# Altium schematic sheet DAC.SchDoc
size A4; SheetNumber: 6; SheetTotal: 8
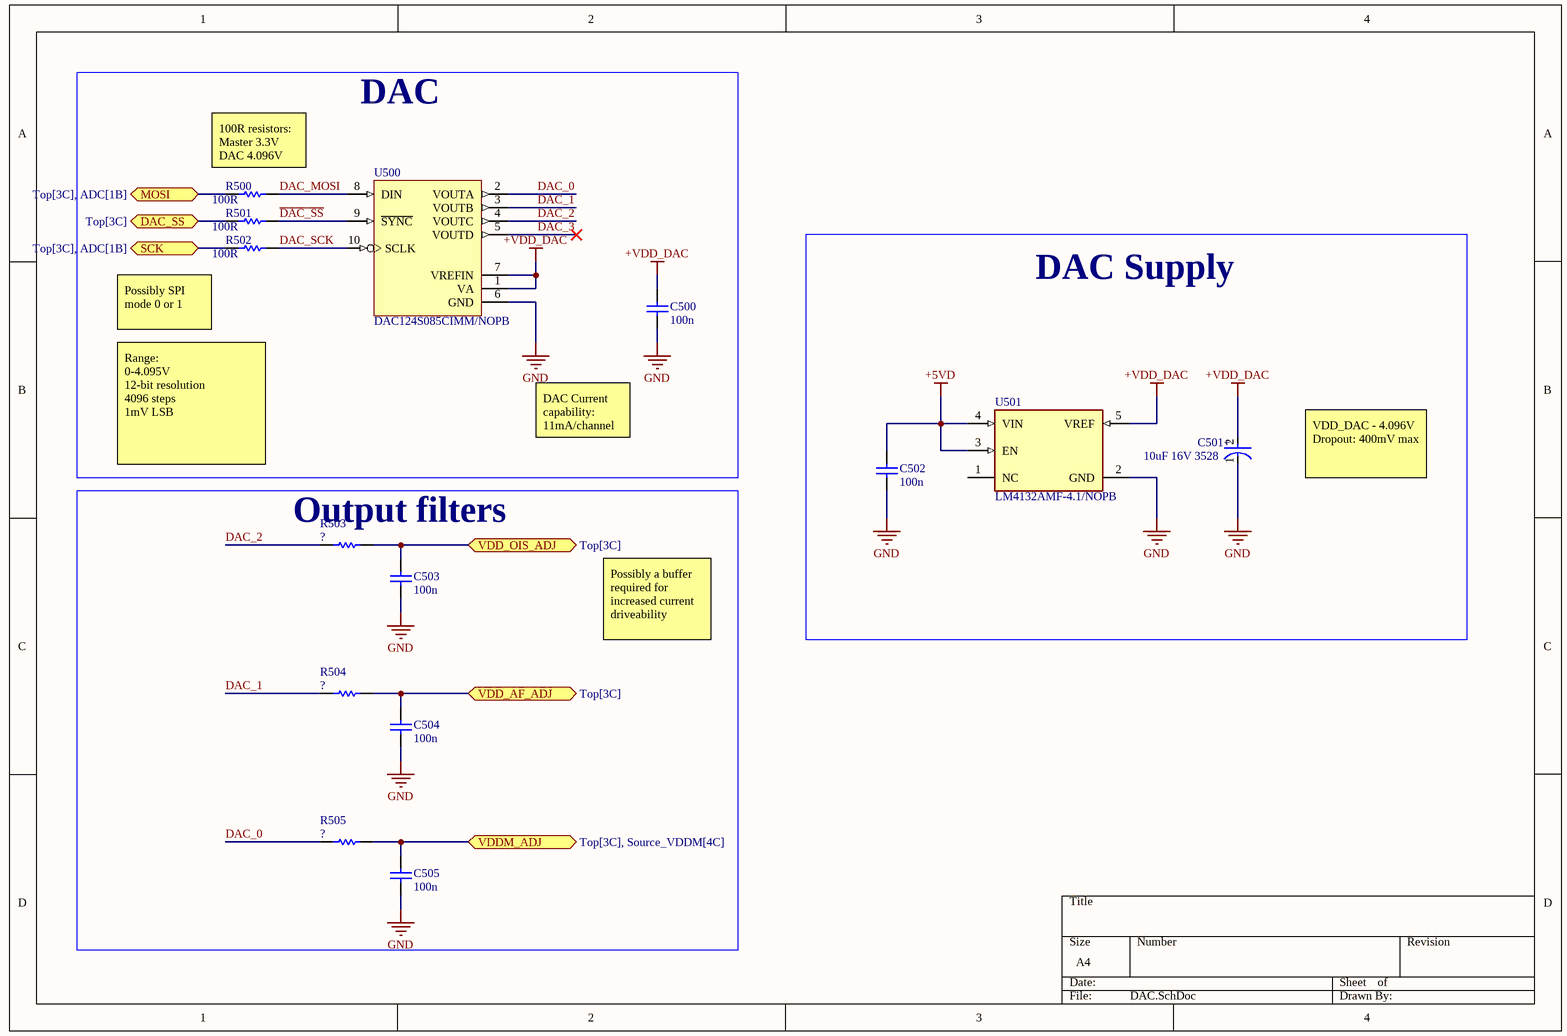
[diagram p0: DAC.SchDoc]

## Parts
C500  100n  [SAMS-C0603-2_M]
C501  10uF 16V 3528  [FP-T491B106K020AT-MFG]
C502  100n  [SAMS-C0603-2_M]
C503  100n  [SAMS-C0603-2_M]
C504  100n  [SAMS-C0603-2_M]
C505  100n  [SAMS-C0603-2_M]
R500  100R  [RESC1608X55X30ML15T15]
R501  100R  [RESC1608X55X30ML15T15]
R502  100R  [RESC1608X55X30ML15T15]
R503  ?  [RESC1608X55X30ML15T15]
R504  ?  [RESC1608X55X30ML15T15]
R505  ?  [RESC1608X55X30ML15T15]
U500  DAC124S085CIMM/NOPB  [MUB10A_L]
U501  LM4132AMF-4.1/NOPB  [FP-DBV0005A-IPC_C]

## Blocks framed on the sheet
DAC: C500 R500-R502 U500
DAC Supply: C501 C502 U501
Output filters: C503-C505 R503-R505

## Ports
DAC_SS (bidir, see Top[3C]), MOSI (bidir, see Top[3C], ADC[1B]), SCK (bidir, see Top[3C], ADC[1B]), VDD_AF_ADJ (bidir, see Top[3C]), VDD_OIS_ADJ (bidir, see Top[3C]), VDDM_ADJ (bidir, see Top[3C], Source_VDDM[4C])

## Nets
+5VD: C502.2 U501.3(EN) U501.4(VIN)
+VDD_DAC: C500.2 C501.2(A) U500.1(VA) U500.7(VREFIN) U501.5(VREF)
GND: C500.1 C501.1(C) C502.1 C503.1 C504.1 C505.1 U500.6(GND) U501.2(GND)
~{DAC_SS}: R501.2 U500.9(~{SYNC})
DAC_0: R505.1 U500.2(VOUTA)
DAC_1: R504.1 U500.3(VOUTB)
DAC_2: R503.1 U500.4(VOUTC)
DAC_3: U500.5(VOUTD)
DAC_MOSI: R500.2 U500.8(DIN)
DAC_SCK: R502.2 U500.10(SCLK)
DAC_SS: R501.1 ; port DAC_SS
MOSI: R500.1 ; port MOSI
SCK: R502.1 ; port SCK
VDD_AF_ADJ: C504.2 R504.2 ; port VDD_AF_ADJ
VDD_OIS_ADJ: C503.2 R503.2 ; port VDD_OIS_ADJ
VDDM_ADJ: C505.2 R505.2 ; port VDDM_ADJ

Not connected (* = marked no-connect by the designer): U501 1(NC)

## Notes on the sheet
- (near R500) 100R resistors:
  Master 3.3V
  DAC 4.096V
- Possibly SPI mode 0 or 1
- DAC Current capability: 11mA/channel
- Range:
  0-4.095V
  12-bit resolution
  4096 steps
  1mV LSB
- VDD_DAC - 4.096V
  Dropout: 400mV max
- Possibly a buffer required for increased current driveability
- (in symbol CMP-2000-07191-2) +

## Library data of the parts
C500 C502-C505 = CMP-2000-05332-1: Multi-layer Ceramic Capacitor, -55 to 125 degC, 2-Pin SMD (0603), RoHS, Tape and Reel; Manufacturer: Samsung Electro-Mechanics; Capacitance: 0.1µF; Rated Voltage: 50V; Dielectric: X7R; Tolerance (%): ±10%; Case Size/Dimension: 0603; Datasheet URL: https://datasheet.ciiva.com/29198/456651-da-01-en-vs-kondensator-0605-29198839.pdf; Manufacturer URL: http://www.samsungsem.com/global/index.jsp; Datasheet Version: Nov-10
C501 = CMP-2000-07191-2: CAP TANT 10UF 10% 20V 1411; Polarity: Polar; Life (Hours): 2000Hour; Dissipation Factor: 6%; Leakage Current: 2uA; Dielectric Material: Tantalum; Ripple Current: 201mA; ESR (Equivalent Series Resistance): 2.1R; Weight: 0.002293oz; Max Operating Temperature: 125°C; Failure Rate: 0.001%; Tolerance: 10%; Case Code (Metric): 3528; Case Code (Imperial): 1411; Number of Pins: 2; Case/Package: 1411; Width: 2.8mm; Height: 1.9mm; Voltage Rating: 20V; Voltage: 20V; Lead Free: Lead Free; Features: General Purpose; Radiation Hardening: No; Min Operating Temperature: -55°C; Length: 3.5mm; Mount: Surface Mount; Depth: 2.8mm; Voltage Rating (DC): 20V; Termination: SMD/SMT; Package Quantity: 1; Capacitance: 10uF; Packaging: Tape and Reel; RoHS Compliant: Yes; REACH SVHC: No SVHC; Height - Seated (Max): 0.083inch
R500-R505 = CMP-2000-00179-1: Manufacturer: Panasonic; Part Number: ERJ-3EKF1000V
U500 = CMP-0061-00134-2: 12-Bit Micro Power QUAD Digital-to-Analog Converter with Rail-to-Rail Output, 10-pin Mini SOIC, Pb-Free; Manufacturer: National Semiconductor; CompType: D/A Converter; PackageTopMarking: ZXTT*X66C; PowerWise: Y; RoHS: Y; ComponentLink1Description: DAC124S085 Datasheet; ComponentLink3Description: MUB10A Package Page; ComponentLink2URL: http://www.national.com/pf/DA/DAC124S085.html; ComponentLink3URL: http://www.national.com/packaging/folders/mub10a.html; PackageDescription: Mini-SO, Molded, .118 x .118 x .034in Body, 10 Lead, .0197in Pitch; PackageReference: MUB10A; ComponentLink2Description: DAC124S085 Web Page; RevisionNote: Component URLs added; Code_JEDEC: MO-187-BA; PinCount: 10; DatasheetVersion: Nov-2008; ComponentLink1URL: http://www.national.com/ds/DA/DAC124S085.pdf; PackageVersion: revB, Jul-2003
U501 = CMP-04916-000024-1: IC VREF SERIES 0.05% SOT23-5; Quiescent Current: 60uA; Max Power Dissipation: 350mW; Reference Voltage: 4.096V; Min Input Voltage: 2.2V; Temperature Coefficient: 10ppm/°C; Max Input Voltage: 6V; Dropout Voltage: 175mV; Max Output Current: 20mA; Number of Pins: 5; Radiation Hardening: No; Series: LM4132; REACH SVHC: No SVHC; Package Quantity: 1000; Height: 1.02mm; Max Operating Temperature: 125°C; Reference Type: Series; Max Output Voltage: 4.096V; Packaging: Tape and Reel; Tolerance: 0.05%; Length: 2.92mm; Min Operating Temperature: -40°C; Nominal Supply Current: 60uA; RoHS Compliant: Yes; Case/Package: SOT-23; Output Voltage: 4.096V; Lead Free: Lead Free; Width: 1.6mm; Output Current: 20mA; Supply Current: 60uA; Termination: SMD/SMT; Mount: Surface Mount